# Altium schematic sheet SV601286G_Schematic.SchDoc: UCC21520EVM-286
size 431 x 279 mm; Date: Jan. 1st, 2016; ApprovedBy: Not shown in title block; CheckedBy: Zhang, Wei; Author: Zhang, Wei; CompanyName: Not shown in title block; DrawnBy: Liban Hussein; Engineer: Liban Hussein; Organization: Not shown in title block; Address1: Not shown in title block; Address2: Not shown in title block; Address3: Not shown in title block; Address4: Not shown in title block; DocumentNumber: 1; Revision: E2; SheetNumber: 1; SheetTotal: 2; PageSetup: Record=PageOptions|CenterHorizontal=True|CenterVertical=True|PrintScale=1.00|XCorrection=1.00|YCorrection=1.00|PrintKind=0|BorderSize=5000000|LeftOffset=0|BottomOffset=0|Orientation=2|PaperLength=1000|PaperWidth=1000|Scale=100|PaperSource=15|PrintQuality=600|MediaType=1|DitherType=10|PaperKind=Letter|PrintScaleMode=1; CurrentTime: Not shown in title block; CurrentDate: Not shown in title block; Time: Not shown in title block; DocumentFullPathAndName: Not shown in title block; DocumentName: UCC21530EVM; ModifiedDate: Not shown in title block; ImagePath: Not shown in title block; ProjectName: Megatron
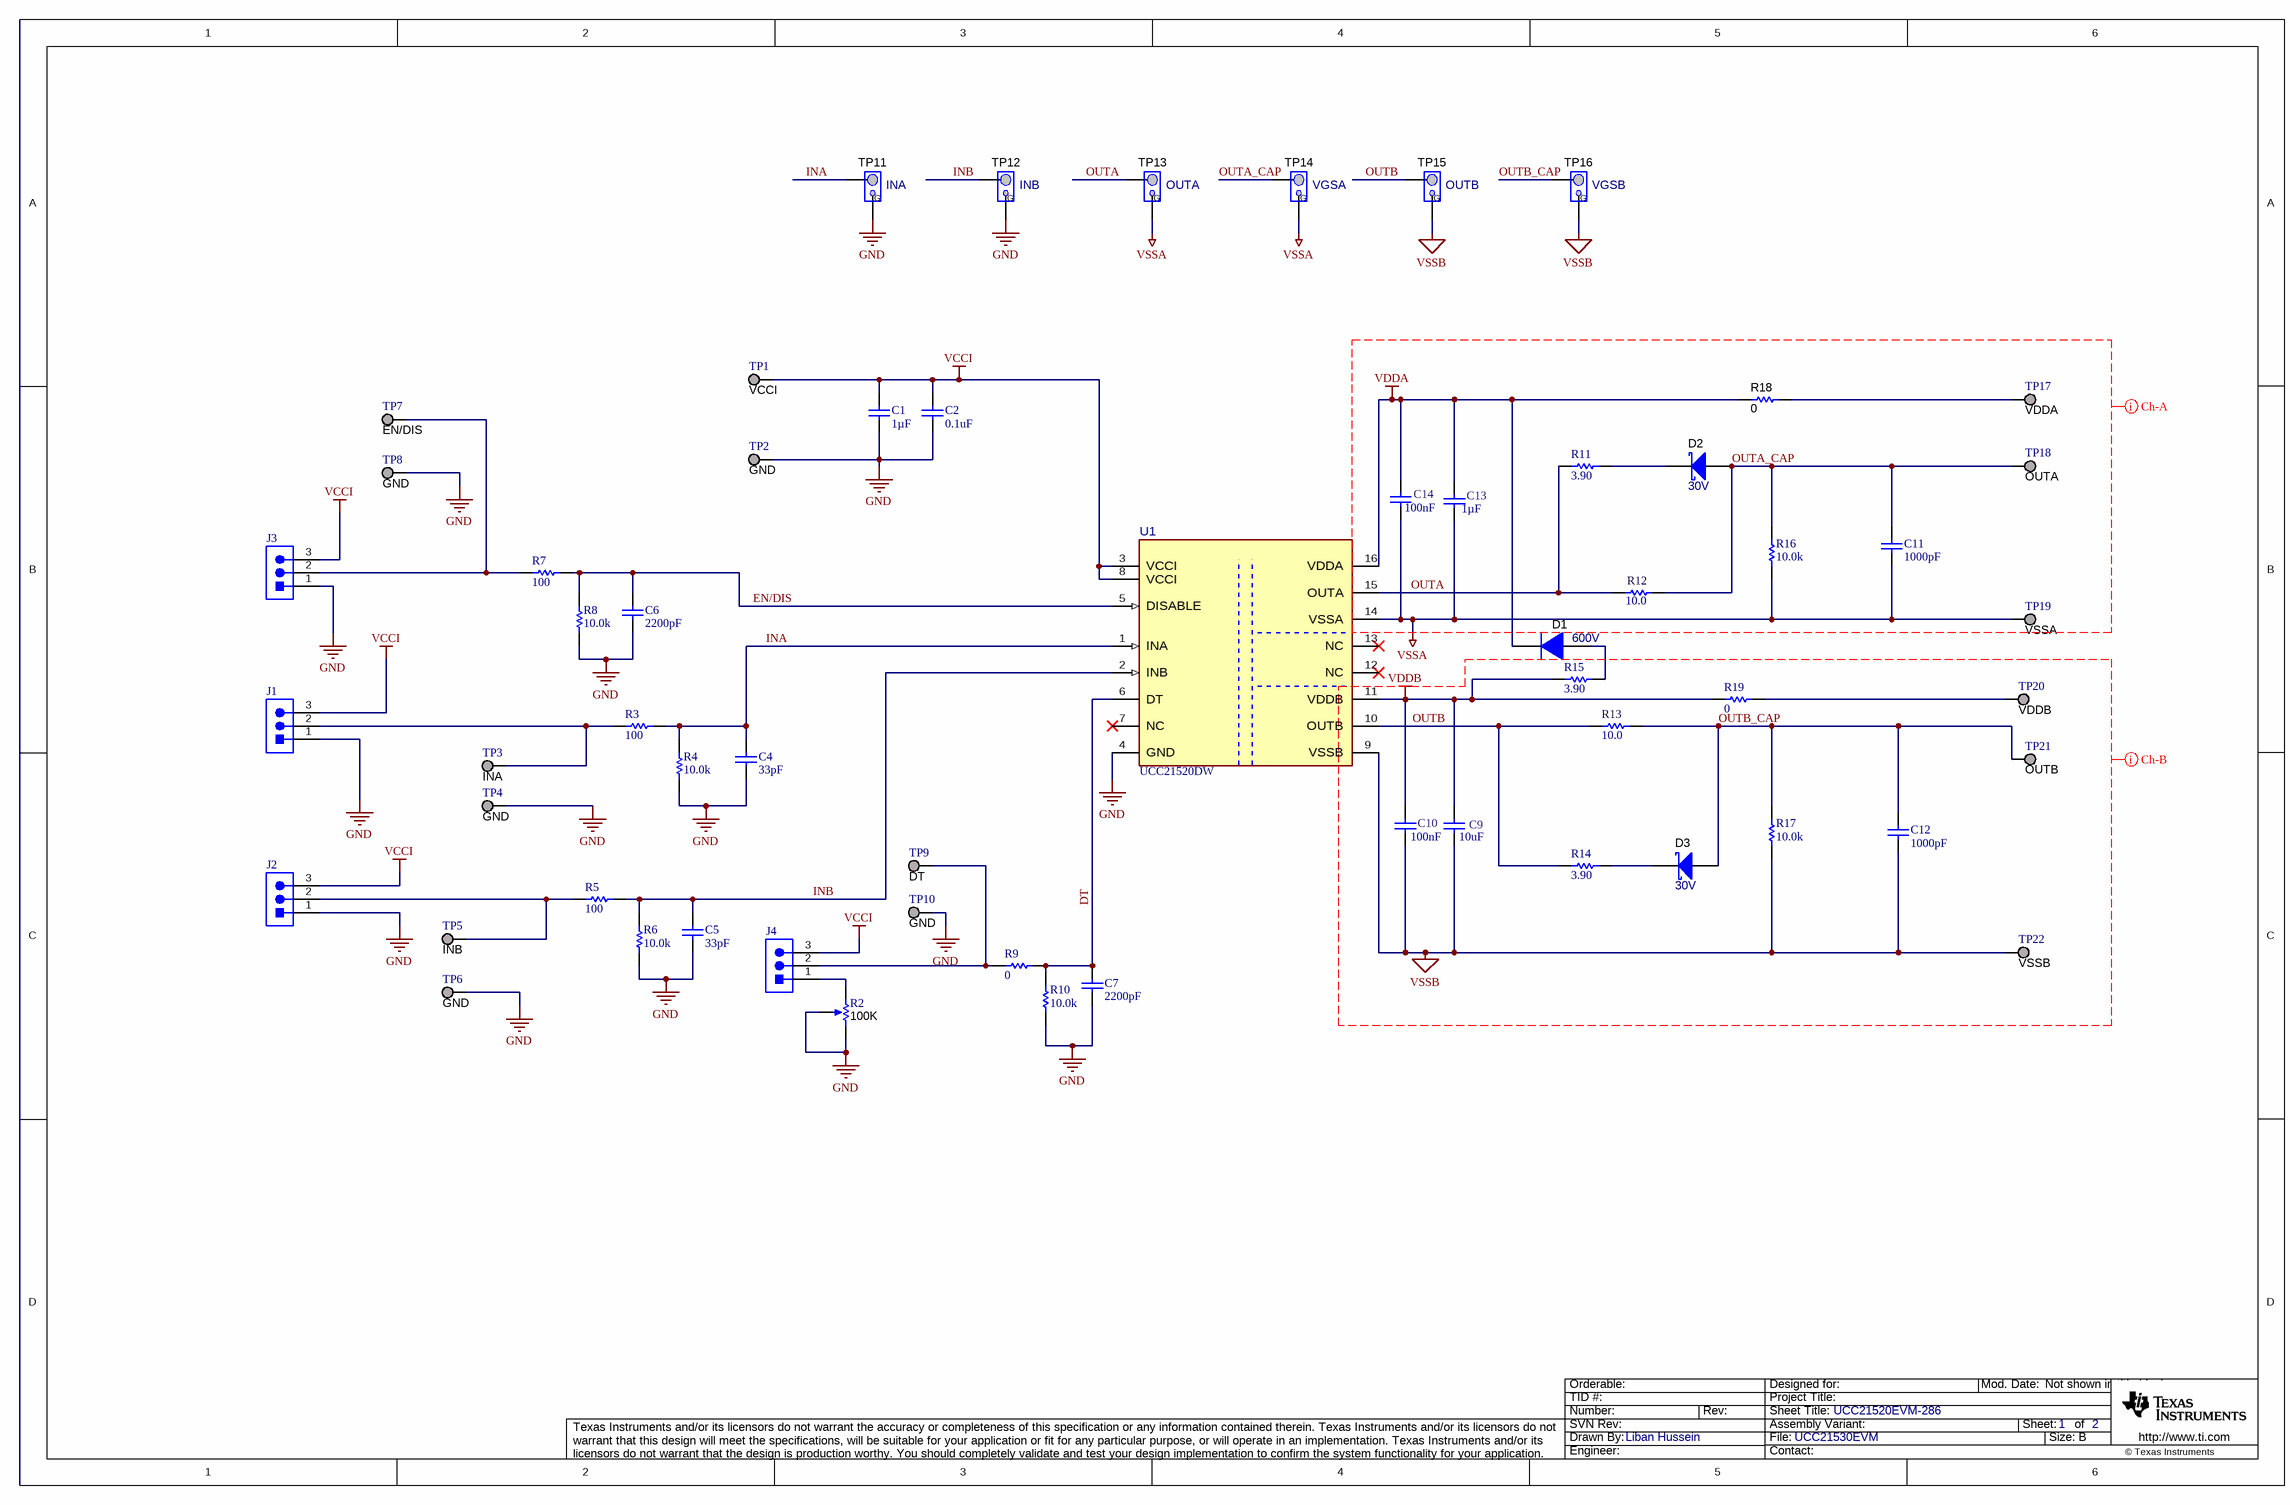
[diagram p0: SV601286G_Schematic.SchDoc]

## Parts
C1  ValueDisplayed: 1µF  [0805_HV1]  (hidden comment: CL21B105KBFNFNE)
C2  ValueDisplayed: 0.1uF  [0603L]  (hidden comment: C1608X7R1E104K080AA)
C4  ValueDisplayed: 33pF  [0603L]  (hidden comment: GRM1885C1H330JA01D)
C5  ValueDisplayed: 33pF  [0603L]  (hidden comment: GRM1885C1H330JA01D)
C6  ValueDisplayed: 2200pF  [0603L]  (hidden comment: C0603C222K5RACTU)
C7  ValueDisplayed: 2200pF  [0603L]  (hidden comment: C0603C222K5RACTU)
C9  ValueDisplayed: 10uF  [1206_180]  (hidden comment: CL31B106KBHNNNE)
C10  Cap_F: 100nF  [0805_HV]  (hidden comment: C0805C104J5RACTU)
C11  ValueDisplayed: 1000pF  [1206L]  (hidden comment: GRM3195C1H102JA01D)
C12  ValueDisplayed: 1000pF  [1206L]  (hidden comment: GRM3195C1H102JA01D)
C13  ValueDisplayed: 1µF  [0805_HV]  (hidden comment: CL21B105KBFNFNE)
C14  Cap_F: 100nF  [0805_HV]  (hidden comment: C0805C104J5RACTU)
D1  600V  [SMA]
D2  30V  [MicroSMP]
D3  30V  [MicroSMP]
J1  TSW-103-07-T-S  [Samtec_TSW-103-07-T-S]  (value not drawn)
J2  TSW-103-07-T-S  [Samtec_TSW-103-07-T-S]  (value not drawn)
J3  TSW-103-07-T-S  [Samtec_TSW-103-07-T-S]  (value not drawn)
J4  TSW-103-07-T-S  [Samtec_TSW-103-07-T-S]  (value not drawn)
R2  value 100K  [TRIM_3224X]  (hidden comment: 3224X-1-104E)
R3  ValueDisplayed: 100  [0603L]  (hidden comment: CRCW0603100RFKEA)
R4  ValueDisplayed: 10.0k  [0603L]  (hidden comment: ERJ-3EKF1002V)
R5  ValueDisplayed: 100  [0603L]  (hidden comment: CRCW0603100RFKEA)
R6  ValueDisplayed: 10.0k  [0603L]  (hidden comment: ERJ-3EKF1002V)
R7  ValueDisplayed: 100  [0603_HV]  (hidden comment: CRCW0603100RFKEA)
R8  ValueDisplayed: 10.0k  [0603L]  (hidden comment: ERJ-3EKF1002V)
R9  ValueDisplayed: 0  [0603L]  (hidden comment: RCS06030000Z0EA)
R10  ValueDisplayed: 10.0k  [0603L]  (hidden comment: ERJ-3EKF1002V)
R11  ValueDisplayed: 3.90  [0805_HV1]  (hidden comment: RC0805FR-073R9L)
R12  ValueDisplayed: 10.0  [0805_HV1]  (hidden comment: ERJ-P06F10R0V)
R13  ValueDisplayed: 10.0  [0805_HV1]  (hidden comment: ERJ-P06F10R0V)
R14  ValueDisplayed: 3.90  [0805_HV1]  (hidden comment: RC0805FR-073R9L)
R15  ValueDisplayed: 3.90  [0805_HV]  (hidden comment: RC0805FR-073R9L)
R16  ValueDisplayed: 10.0k  [0603L]  (hidden comment: ERJ-3EKF1002V)
R17  ValueDisplayed: 10.0k  [0603L]  (hidden comment: ERJ-3EKF1002V)
R18  ValueDisplayed: 0  [0603L]  (hidden comment: RCS06030000Z0EA)
R19  ValueDisplayed: 0  [0603L]  (hidden comment: RCS06030000Z0EA)
TP1  VCCI  [Keystone_5019]
TP2  GND  [Keystone_5019]
TP3  INA  [Keystone_5019]
TP4  GND  [Keystone_5019]
TP5  INB  [Keystone_5019]
TP6  GND  [Keystone_5019]
TP7  EN/DIS  [Keystone_5019]
TP8  GND  [Keystone_5019]
TP9  DT  [Keystone_5019]
TP10  GND  [Keystone_5019]
TP11  INA  [TESTPOINT_PIGTAIL]  (no BOM)
TP12  INB  [TESTPOINT_PIGTAIL]  (no BOM)
TP13  OUTA  [TESTPOINT_PIGTAIL]  (no BOM)
TP14  VGSA  [TESTPOINT_PIGTAIL]  (no BOM)
TP15  OUTB  [TESTPOINT_PIGTAIL]  (no BOM)
TP16  VGSB  [TESTPOINT_PIGTAIL]  (no BOM)
TP17  VDDA  [Keystone_5019]
TP18  OUTA  [Keystone_5019]
TP19  VSSA  [Keystone_5019]
TP20  VDDB  [Keystone_5019]
TP21  OUTB  [Keystone_5019]
TP22  VSSB  [Keystone_5019]
U1  UCC21520DW  [DW0016B-MFG]

## Nets
GND: C1.2 C2.2 C4.2 C5.2 C6.2 C7.2 J1.1 J2.1 J3.1 R2.2(WIPER) R2.3(CW) R4.1 R6.1 R8.1 R10.1 TP2.1 TP4.1 TP6.1 TP8.1 TP10.1 TP11.2 TP12.2 U1.4(GND)
VCCI: C1.1 C2.1 J1.3 J2.3 J3.3 J4.3 TP1.1 U1.3(VCCI) U1.8(VCCI)
VDDA: C13.1 C14.1 D1.1(K) R18.1 U1.16(VDDA)
VDDB: C9.1 C10.2 R15.1 R19.1 U1.11(VDDB)
VSSA: C11.2 C13.2 C14.2 R16.1 TP13.2 TP14.2 TP19.1 U1.14(VSSA)
VSSB: C9.2 C10.1 C12.2 R17.1 TP15.2 TP16.2 TP22.1 U1.9(VSSB)
DT: C7.1 R9.2 R10.2 U1.6(DT)
EN/DIS: C6.1 R7.2 R8.2 U1.5(DISABLE)
INA: C4.1 R3.2 R4.2 TP11.1 U1.1(INA)
INB: C5.1 R5.2 R6.2 TP12.1 U1.2(INB)
OUTA: R11.1 R12.1 TP13.1 U1.15(OUTA)
OUTA_CAP: C11.1 D2.2(A) R12.2 R16.2 TP14.1 TP18.1
OUTB: R13.1 R14.1 TP15.1 U1.10(OUTB)
OUTB_CAP: C12.1 D3.2(A) R13.2 R17.2 TP16.1 TP21.1
NetD1_2: D1.2(A) R15.2
NetD2_1: D2.1(K) R11.2
NetD3_1: D3.1(K) R14.2
NetJ1_2: J1.2 R3.1 TP3.1
NetJ2_2: J2.2 R5.1 TP5.1
NetJ3_2: J3.2 R7.1 TP7.1
NetJ4_1: J4.1 R2.1(CCW)
NetJ4_2: J4.2 R9.1 TP9.1
NetR18_2: R18.2 TP17.1
NetR19_2: R19.2 TP20.1

Not connected (* = marked no-connect by the designer): U1 7(NC)* 12(NC)* 13(NC)*

## Layout directives
net class Ch-A: OUTA, OUTA_CAP, VDDA
net class Ch-B: OUTB, OUTB_CAP, VDDB, VSSB

## Notes on the sheet
- Drawn By:
- SVN Rev:
- Number:
- TID #:
- Orderable:
- Rev:
- Sheet Title:
- File:
- Project Title:
- Designed for:
- Assembly Variant:
- Mod. Date:
- Sheet:
- Size:
- of
- B
- http://www.ti.com
- Texas Instruments and/or its licensors do not warrant the accuracy or completeness of this specification or any information contained therein. Texas Instruments and/or its licensors do not warrant that this design will meet the specifications, will be suitable for your application or fit for any particular purpose, or will operate in an implementation. Texas Instruments and/or its licensors do not warrant that the design is production worthy. You should completely validate and test your design implementation to confirm the system functionality for your application.
- Engineer:
- Contact:
- © Texas Instruments
- (in symbol CMP-0003907-1) G

## Library data of the parts
C1 = CMP-0080611-1: CAP, CERM, 1 µF, 50 V,+/- 10%, X7R, 0805; Manufacturer: Samsung; TaMin_C: -55°C; Polarized: N; SizeAreaWB_mm2: 6.75; U/M: EA; Value: 1uF; TaMax_C: 125°C; SizeZ_mm: 1.45; SizeX_mm: 2; SizeY_mm: 1.25; Cap_Case: 0805; Value2: 50V; SizeArea_mm2: 2.5; AEC Category: Q200; ComponentLink1URL: http://www.samsungsem.com/kr/support/product-search/mlcc/__icsFiles/afieldfile/2016/08/18/S_CL21B105KBFNFNE.pdf; TempCo: X7R; RoHS: Y; MountType: SMT; Supplier 1: Digi-Key; PackageReference: 0805; Tolerance_%: 10%; CompType: Capacitor; PartNumber: CL21B105KBFNFNE; AEC Qualified: N; Cap_F: 1µF; VDC_V: 50V; ComponentLink1Description: Datasheet link; AEC Grade: N/A; Supplier Part Number 1: 1276-2928-1-ND; Technology: Ceramic
C2 = CMP-0007039-5: CAP, CERM, 0.1 uF, 25 V, +/- 10%, X7R, 0603; Manufacturer: TDK; TaMin_C: -55°C; Polarized: N; SizeAreaWB_mm2: 4.68; Value1: Unknown; U/M: EA; Value: 0.1uF; TaMax_C: 125°C; SizeZ_mm: 1; SizeX_mm: 1.6; SizeY_mm: 0.8; Cap_Case: 0603; Value2: 25V; SizeArea_mm2: 1.28; Cap_F: 100nF; AEC Category: Q200; Supplier Part Number 2: 87R3692; Publisher: Texas Instruments; Supplier 2: Newark; TempCo: X7R; Published: 2008-06-19; RoHS: Y; MountType: SMT; Supplier 1: Digi-Key; PackageReference: 0603; Tolerance_%: 10%; CompType: Capacitor; LatestRevisionDate: 2017-03-09; PartNumber: C1608X7R1E104K080AA; AEC Qualified: ?; VDC_V: 25V; ComponentLink1Description: Datasheet link; Supplier Part Number 1: 445-1316-1-ND; Technology: Ceramic; ComponentLink1URL: http://www.tdk.com/pdf/TDKMLCCCapRange.pdf
C4 C5 = CMP-0007208-4: CAP, CERM, 33 pF, 50 V, +/- 5%, C0G/NP0, 0603; Manufacturer: MuRata; TaMin_C: -55°C; Polarized: N; SizeAreaWB_mm2: 4.68; Value1: Unknown; U/M: EA; Value: 33pF; TaMax_C: 125°C; SizeZ_mm: 1; SizeX_mm: 1.6; SizeY_mm: 0.8; Cap_Case: 0603; Value2: 50V; SizeArea_mm2: 1.28; AEC Category: Q200; Supplier Part Number 2: 81-GRM39C330J50; Publisher: Texas Instruments; Supplier 2: Mouser; TempCo: C0G/NP0; Published: 2008-06-19; RoHS: Y; MountType: SMT; Supplier 1: Digi-Key; PackageReference: 0603; Tolerance_%: 5%; CompType: Capacitor; LatestRevisionDate: 2017-03-09; PartNumber: GRM1885C1H330JA01D; AEC Qualified: ?; Cap_F: 33pF; VDC_V: 50V; ComponentLink1Description: Datasheet link; Supplier Part Number 1: 490-1415-1-ND; Technology: Ceramic; ComponentLink1URL: http://search.murata.co.jp/Ceramy/PnsearchViewAction.do?HnOFG=ON&HnNFG=ON&SEL_CNT=50&sLang=en&sKey=GRM1885C1H330JA01D&x=9&y=9&search=startwith; Supplier 3: Farnell; Supplier Part Number 3: 1828910
C6 C7 = CMP-0006898-4: CAP, CERM, 2200 pF, 50 V, +/- 10%, X7R, 0603; Manufacturer: Kemet; TaMin_C: -55°C; Polarized: N; SizeAreaWB_mm2: 4.68; Value1: Unknown; U/M: EA; Value: 2200pF; TaMax_C: 125°C; SizeZ_mm: 1; SizeX_mm: 1.6; SizeY_mm: 0.8; Cap_Case: 0603; Value2: 50V; SizeArea_mm2: 1.28; Cap_F: 2.2nF; AEC Category: Q200; Publisher: Texas Instruments; TempCo: X7R; Published: 2008-06-19; RoHS: Y; MountType: SMT; Supplier 1: Digi-Key; PackageReference: 0603; Tolerance_%: 10%; CompType: Capacitor; LatestRevisionDate: 2017-03-09; PartNumber: C0603C222K5RACTU; AEC Qualified: ?; VDC_V: 50V; ComponentLink1Description: Datasheet link; Supplier Part Number 1: 399-1085-1-ND; Technology: Ceramic; ComponentLink1URL: http://www.kemet.com/kemet/web/homepage/kechome.nsf/vapubfiles/F3102_Y5V.pdf/$file/F3102_Y5V.pdf; Supplier 2: Mouser; Supplier 3: Farnell; Supplier Part Number 2: 80-C0603C222K5R; Supplier Part Number 3: 1414624
C9 = CMP-0008802-1: CAP, CERM, 10 uF, 50 V, +/- 10%, X7R, 1206; Manufacturer: Samsung; TaMin_C: -55°C; Polarized: N; SizeAreaWB_mm2: 10.92; U/M: EA; Value: 10uF; TaMax_C: 125°C; SizeZ_mm: 1.8; SizeX_mm: 3.2; SizeY_mm: 1.6; Cap_Case: 1206; Value2: 50V; SizeArea_mm2: 5.12; Cap_F: 10µF; AEC Category: Q200; Value1: Unknown; ComponentLink1URL: https://www.samsungsem.com/kr/front/downloadcms.do?path=%2Fkr%2Fsupport%2Fproduct-search%2Fmlcc%2F__icsFiles%2Fafieldfile%2F2016%2F01%2F04&fileName=Data+sheet_CL31B106KBHNNNE.pdf; TempCo: X7R; RoHS: Y; MountType: SMT; Supplier 1: Digi-Key; PackageReference: 1206; Tolerance_%: 10%; CompType: Capacitor; PartNumber: CL31B106KBHNNNE; AEC Qualified: N; ComponentLink1Description: Datasheet link; AEC Grade: N/A; Supplier Part Number 1: 1276-6767-1-ND; Technology: Ceramic; LatestRevisionDate: 2017-03-09; Published: 2008-06-19; Publisher: Texas Instruments
C10 C14 = CMP-0007721-1: CAP, CERM, 0.1 uF, 50 V, +/- 5%, X7R, 0805; Manufacturer: Kemet; TaMin_C: -55°C; ESR_ohm: 0.064; Polarized: N; SizeAreaWB_mm2: 6.75; Value1: 0.064 ohm; U/M: EA; Value: 0.1uF; TaMax_C: 125°C; SizeZ_mm: 1.45; SizeX_mm: 2; SizeY_mm: 1.25; Cap_Case: 0805; Value2: 50V; SizeArea_mm2: 2.5; IRMS_A: 1.64A; AEC Category: Q200; ComponentLink1URL: http://www.kemet.com/kemet/web/homepage/kechome.nsf/file/Partial%20Copy%20-%20Ceramic%20Surface%20Mount%20Capacitors/$file/F3102_CE.pdf; Supplier Part Number 2: 80-C0805C104J5R; Publisher: Texas Instruments; Supplier 2: Mouser; Supplier Part Number 3: 1414663; TempCo: X7R; Supplier 3: Farnell; Published: 2008-06-19; RoHS: Y; MountType: SMT; Supplier 1: Newark; PackageReference: 0805; Tolerance_%: 5%; CompType: Capacitor; LatestRevisionDate: 2017-03-09; PartNumber: C0805C104J5RACTU; AEC Qualified: ?; ComponentLink1Description: Datasheet link; Supplier Part Number 1: 64K2889; Technology: Ceramic; ValueDisplayed: 0.1uF
C11 C12 = CMP-0008829-2: CAP, CERM, 1000 pF, 50 V, +/- 5%, C0G/NP0, 1206; Manufacturer: MuRata; TaMin_C: -55°C; Polarized: N; SizeAreaWB_mm2: 10.92; Value1: Unknown; U/M: EA; Value: 1000pF; TaMax_C: 125°C; SizeZ_mm: 1.35; SizeX_mm: 3.2; SizeY_mm: 1.6; Cap_Case: 1206; Value2: 50V; SizeArea_mm2: 5.12; Cap_F: 1nF; AEC Category: Q200; Supplier Part Number 2: 81-GRM426C102J050D; Publisher: Texas Instruments; Supplier 2: Mouser; TempCo: C0G/NP0; Published: 2008-06-19; RoHS: Y; MountType: SMT; Supplier 1: Digi-Key; PackageReference: 1206; Tolerance_%: 5%; CompType: Capacitor; LatestRevisionDate: 2017-03-09; PartNumber: GRM3195C1H102JA01D; AEC Qualified: ?; VDC_V: 50V; ComponentLink1Description: Datasheet link; Supplier Part Number 1: 490-1749-1-ND; Technology: Ceramic; ComponentLink1URL: http://search.murata.co.jp/Ceramy/PnsearchViewAction.do?HnOFG=ON&HnNFG=ON&SEL_CNT=50&sLang=en&sKey=GRM3195C1H102JA01D&x=9&y=9&search=startwith
C13 = CMP-0080611-1: CAP, CERM, 1 µF, 50 V,+/- 10%, X7R, 0805; Manufacturer: Samsung; TaMin_C: -55°C; Polarized: N; SizeAreaWB_mm2: 6.75; U/M: EA; Value: 1uF; TaMax_C: 125°C; SizeZ_mm: 1.45; SizeX_mm: 2; SizeY_mm: 1.25; Cap_Case: 0805; Value2: 50V; SizeArea_mm2: 2.5; CompType: Capacitor; AEC Category: Q200; ComponentLink1URL: http://www.samsungsem.com/kr/support/product-search/mlcc/__icsFiles/afieldfile/2016/08/18/S_CL21B105KBFNFNE.pdf; TempCo: X7R; RoHS: Y; MountType: SMT; Supplier 1: Digi-Key; PackageReference: 0805; Tolerance_%: 10%; PartNumber: CL21B105KBFNFNE; AEC Qualified: N; Cap_F: 1µF; VDC_V: 50V; ComponentLink1Description: Datasheet link; AEC Grade: N/A; Supplier Part Number 1: 1276-2928-1-ND; Technology: Ceramic
D1 = CMP-0076908-2: Diode, Ultrafast, 600 V, 1 A, SMA; PartNumber: STTH1R06A; Manufacturer: STMicroelectronics; TJmax_C: 175°C; Vf_V: 1V; SizeZ_mm: 2.87; AEC Category: Q101; Green_Lifecycle: Active; Green_REACh: Passed; Io_A: 1A; RJC_CperW: 30.0; SizeArea_mm2: 16.3228; SizeAreaWB_mm2: 37.3428; SizeX_mm: 5.59; SizeY_mm: 2.92; RoHS: Y; ComponentLink1Description: Datasheet link; AEC Qualified: ?; ComponentLink1URL: http://www.st.com/web/en/resource/technical/document/datasheet/CD00005135.pdf; PackageReference: SMA; CompType: Diode; Green_EU RoHS-2: Passed; Green_EU RoHS: Passed with Exemption; MountType: SMT; Type: Ultrafast; Value1: 1A; Value2: 1V; Value: 600V; Vr_V: 600V
D2 D3 = CMP-0028774-2: Diode, Schottky, 30 V, 1 A, AEC-Q101, MicroSMP; Manufacturer: Vishay-Semiconductor; PartNumber: MSS1P3L-M3/89A; Io_A: 1A; Green_Lifecycle: Not Set; SizeAreaWB_mm2: 8.05; Green_REACh: Incomplete; TJmax_C: 150°C; SizeZ_mm: 0.73; SizeX_mm: 2.5; SizeY_mm: 1.3; Vf_V: 350mV; Value2: 0.35V; SizeArea_mm2: 3.25; AEC Qualified: Y; AEC Category: Q101; RJC_CperW: 40; ComponentLink1URL: http://www.vishay.com/docs/89020/mss1p3l.pdf; Vr_V: 30V; RoHS: Y; Value1: 1A; MountType: SMT; Green_EU RoHS-2: Incomplete; Value: 30V; Green_EU RoHS: Incomplete; PackageReference: MicroSMP; CompType: Diode; Type: Schottky; ComponentLink1Description: Datasheet link
J1-J4 = CMP-0075530-2: Header, 2.54 mm, 3x1, Tin, TH; Manufacturer: Samtec; Pitch_mm: 2.54; Cert_VDE: N; Gender: Male; Cert_CSA: Y; Voltage_V: 550V; Green_REACh: Passed; Current_A: 6.3A; Green_Lifecycle: Active; Row_Count: 1; ComponentLink1Description: Datasheet URL; RoHS: Y; Supplier Part Number 3: 2035682; Supplier 1: Digi-Key; Cert_UL: Y; Orientation: Vertical; Green_EU RoHS: Passed; PackageReference: Header, 2.54 mm, 3x1, TH; Color: Black; PartNumber: TSW-103-07-T-S; PinCount: 3; Supplier Part Number 2: 12P1325; ContactFinish: Tin; Supplier 2: Newark; Cert_CULUS: N; Shrouded: N; ClassName: Header; ComponentLink1URL: http://www.samtec.com/ftppub/cpdf/TSW-XXX-XX-XXX-X-XX-XXX-MKT.pdf; CompType: Header; MountType: TH; Supplier Part Number 1: SAM1035-03-ND; Supplier 3: Farnell; Green_EU RoHS-2: Passed
R2 = CMP-0002065-2: Trimmer, 100 K, 0.25 W, SMD; Manufacturer: Bourns; Publisher: Texas Instruments; MountType: SMT; ComponentLink1Description: Datasheet URL; Supplier 2: Newark; Supplier 3: Mouser; Supplier 1: Digi-Key; Supplier Part Number 1: 3224X-1-104ECT-ND; Supplier Part Number 2: 06X8878; Supplier Part Number 3: 652-3224X-1-104E; LatestRevisionDate: 09/03/2017; PartNumber: 3224X-1-104E; PackageReference: 3.5x5.3x4.8mm; CompType: Trimmer; RoHS: Y; ComponentLink1URL: https://www.bourns.com/data/global/pdfs/3224.pdf
R3 R5 R7 = CMP-0021991-4: RES, 100, 1%, 0.1 W, AEC-Q200 Grade 0, 0603; Manufacturer: Vishay-Dale; Power_W: 100mW; TempCo: 100 ppm/C; Value_Code: 100R; Value: 100; EIA_Code: E96; SizeX_mm: 1.6; SizeY_mm: 0.8; SizeZ_mm: 1; Value2: 0.1W; SizeArea_mm2: 1.28; AEC Qualified: Y; VDC_V: 75V; AEC Category: Q200; AEC Grade: 0; Supplier Part Number 2: 52K8078; Supplier 2: Newark; Supplier Part Number 3: 71-CRCW0603-100-E3; Supplier 3: Mouser; RoHS: E; Value1: 1%; MountType: SMT; Supplier 1: Digi-Key; PackageReference: 0603; Tolerance_%: 1%; Res_ohm: 100; CompType: Resistor; PartNumber: CRCW0603100RFKEA; ComponentLink1Description: Datasheet link; Supplier Part Number 1: 541-100HCT-ND; Technology: Thick Film; ComponentLink1URL: http://www.vishay.com/docs/20035/dcrcwe3.pdf
R4 R6 R10 R16 R17 = CMP-0022684-3: RES, 10.0 k, 1%, 0.1 W, 0603; Manufacturer: Panasonic; Power_W: 100mW; TempCo: 100 ppm/C; Value_Code: 10k0; U/M: EA; Value: 10.0k; EIA_Code: E96; Res_ohm: 10k; SizeX_mm: 1.6; SizeY_mm: 0.8; SizeZ_mm: 1; Value2: 0.1W; SizeArea_mm2: 1.28; CompType: Resistor; VDC_V: 75V; AEC Category: Q200; Supplier Part Number 2: 64R5309; Publisher: Texas Instruments; Supplier 2: Newark; Supplier Part Number 3: 667-ERJ-3EKF1002V; Supplier 3: Mouser; Published: 2008-06-26; RoHS: Y; Value1: 1%; MountType: SMT; Supplier 1: Digi-Key; PackageReference: 0603; Tolerance_%: 1%; LatestRevisionDate: 2017-03-09; PartNumber: ERJ-3EKF1002V; AEC Qualified: ?; ComponentLink1Description: Datasheet link; Supplier Part Number 1: P10.0KHCT-ND; Technology: Thick Film; ComponentLink1URL: http://industrial.panasonic.com/www-data/pdf/AOA0000/AOA0000CE2.pdf
R8 = CMP-0022684-3: RES, 10.0 k, 1%, 0.1 W, 0603; Manufacturer: Panasonic; Power_W: 100mW; TempCo: 100 ppm/C; Value_Code: 10k0; U/M: EA; Value: 10.0k; EIA_Code: E96; Res_ohm: 10k; SizeX_mm: 1.6; SizeY_mm: 0.8; SizeZ_mm: 1; Value2: 0.1W; SizeArea_mm2: 1.28; VDC_V: 75V; AEC Category: Q200; Supplier Part Number 2: 64R5309; Publisher: Texas Instruments; Supplier 2: Newark; Supplier Part Number 3: 667-ERJ-3EKF1002V; Supplier 3: Mouser; Published: 2008-06-26; RoHS: Y; Value1: 1%; MountType: SMT; Supplier 1: Digi-Key; PackageReference: 0603; Tolerance_%: 1%; CompType: Resistor; LatestRevisionDate: 2017-03-09; PartNumber: ERJ-3EKF1002V; AEC Qualified: ?; ComponentLink1Description: Datasheet link; Supplier Part Number 1: P10.0KHCT-ND; Technology: Thick Film; ComponentLink1URL: http://industrial.panasonic.com/www-data/pdf/AOA0000/AOA0000CE2.pdf
R9 R18 R19 = CMP-0081973-1: RES, 0, 0%, 0.25 W, AEC-Q200 Grade 0, 0603; Manufacturer: Vishay-Dale; SizeAreaWB_mm2: 4.68; SizeArea_mm2: 1.28; AEC Qualified: Y; AEC Category: Q200; Value: 0; SizeZ_mm: 1; SizeY_mm: 0.8; Power_W: 250mW; Value2: 0.25W; CompType: Resistor; SizeX_mm: 1.6; ComponentLink1Description: Datasheet link; RoHS: Y; Tolerance_%: 0%; Value_Code: 0; Supplier 1: Digi-Key; PackageReference: 0603; Technology: Thick Film; Res_ohm: 0; PartNumber: RCS06030000Z0EA; Supplier Part Number 2: 71-RCS06030000Z0EA; Supplier 2: Mouser; AEC Grade: 0; ComponentLink1URL: http://www.vishay.com/docs/20065/rcse3.pdf; Value1: 0%; MountType: SMT; Supplier Part Number 1: 541-2779-1-ND
R11 R14 R15 = CMP-0021926-2: RES, 3.90, 1%, 0.125 W, 0805; Manufacturer: Yageo America; Power_W: 125mW; TempCo: 200 ppm/C; Value_Code: 3R90; U/M: EA; Value: 3.90; Res_ohm: 3.9; SizeX_mm: 2; SizeY_mm: 1.25; SizeZ_mm: 1.45; Value2: 0.125W; SizeArea_mm2: 2.5; CompType: Resistor; VDC_V: 150V; AEC Category: Q200; Supplier Part Number 2: 603-RC0805FR-073R9L; Publisher: Texas Instruments; Supplier 2: Mouser; Supplier Part Number 3: 9237194; Supplier 3: Farnell; Published: 2008-06-26; RoHS: Y; Value1: 1%; MountType: SMT; Supplier 1: Digi-Key; PackageReference: 0805; Tolerance_%: 1%; LatestRevisionDate: 2017-03-09; PartNumber: RC0805FR-073R9L; AEC Qualified: ?; ComponentLink1Description: Datasheet link; Supplier Part Number 1: 311-3.90CRCT-ND; Technology: Thick Film; ComponentLink1URL: http://www.yageo.com/pdf/Pu-RC0805_51_PbFree_L_2.pdf
R12 R13 = CMP-0021849-2: RES, 10.0, 1%, 0.5 W, AEC-Q200 Grade 0, 0805; Manufacturer: Panasonic; Power_W: 500mW; TempCo: 300 ppm/C; Value_Code: 10R0; U/M: EA; Value: 10.0; EIA_Code: E96; Res_ohm: 10; SizeX_mm: 2; SizeY_mm: 1.25; SizeZ_mm: 1.45; Value2: 0.5W; SizeArea_mm2: 2.5; AEC Qualified: Y; AEC Grade: 0; AEC Category: Q200; Supplier Part Number 2: 32R9412; Publisher: Texas Instruments; Supplier 2: Newark; Supplier Part Number 3: 667-ERJ-P06F10R0V; Supplier 3: Mouser; Published: 2008-06-26; RoHS: Y; Value1: 1%; MountType: SMT; Supplier 1: Digi-Key; PackageReference: 0805; Tolerance_%: 1%; CompType: Resistor; LatestRevisionDate: 2017-03-09; PartNumber: ERJ-P06F10R0V; ComponentLink1Description: Datasheet link; Supplier Part Number 1: P18937CT-ND; Technology: Thick Film; ComponentLink1URL: https://industrial.panasonic.com/cdbs/www-data/pdf/RDA0000/AOA0000C243.pdf
TP1-TP10 TP17-TP22 = CMP-0055162-1: Test Point, Miniature, SMT; Manufacturer: Keystone; PartNumber: 5019; CNHeader: FALSE; Green_Lifecycle: Active; Green_REACh: Passed; CT: TRUE; ComponentLink1URL: http://www.keyelco.com/product-pdf.cfm?p=1357; Supplier Part Number 2: 534-5019; Publisher: Texas Instruments; Supplier 2: Mouser; RoHS: Y; MountType: SMT; Green_EU RoHS-2: Incomplete; Supplier 1: Digi-Key; Green_EU RoHS: Passed; PackageReference: Test Point, Miniature, SMT; CompType: Test Point; LatestRevisionDate: 26/05/2017; ComponentLink1Description: Datasheet URL; Supplier Part Number 1: 36-5019TR-ND
TP11-TP16 = CMP-0003907-1: PIGTAIL; Manufacturer: Texas Instruments; CompType: Test Point; Key: TESTPOINT_PIGTAIL; Publisher: Texas Instruments; PackageReference: Pigtail Test Point; LatestRevisionDate: 2017-03-09; MountType: TH; PartNumber: TESTPOINT_PIGTAIL; ComponentLink1Description: Datasheet Link
U1 = CMP-0090067-1: Driver 6A 2-OUT High Side/Low Side Half Brdg Non-Inv 16-Pin SOIC Tube; Manufacturer: Texas Instruments; Standoff Height: 0.1mm; Nominal Supply Current: 2mA; SizeZ_mm: 2.65mm; TJmax_C: +130°C; Number Of Drivers: 2; Propagation Delay: 19ns; Min Supply Voltage: 3V; Max Power Dissipation: 1.05W; Max Supply Voltage: 18V; Fall Time: 7ns; Rise Time: 6ns; TaMin_C: -40°C; Output Voltage: 6.5-25V; AEC Qualified: No; TaMax_C: +125°C; Digikey Description: DGTL ISO 5.7KV GATE DRVR 16SOIC; Operating Temperature Range: -40°C to +125°C; Lead Free: Yes; Datasheet Path: datasheets/IC-UCC21520DW.pdf; Digikey Part Number: 296-44611-5-ND; PartNumber: UCC21520DW; datasheet: https://www.ti.com/lit/ds/symlink/ucc21520.pdf; Part Number: UCC21520DW; Mouser Part Number: 595-UCC21520DW; PackageReference: SOIC16; ComponentLink1URL: https://www.ti.com/lit/ds/symlink/ucc21520.pdf; ComponentLink1Description: Datasheet; Number Of Outputs: 2; helpURL: https://upverter.com/upn/revision/31eb2827e17e9876/; RoHS: TRUE